# EasyEDA Pro project STM32F103c8t6抄板.eprj

# Schematic Schematic1
Create Date: 2024-08-23; Page Name: P1; Project Name: STM32F103c8t6抄板; Schematic Name: Schematic1; Update Date: 2024-08-26; Company: 嘉立创EDA; Page Size: A4; Version: V1.0
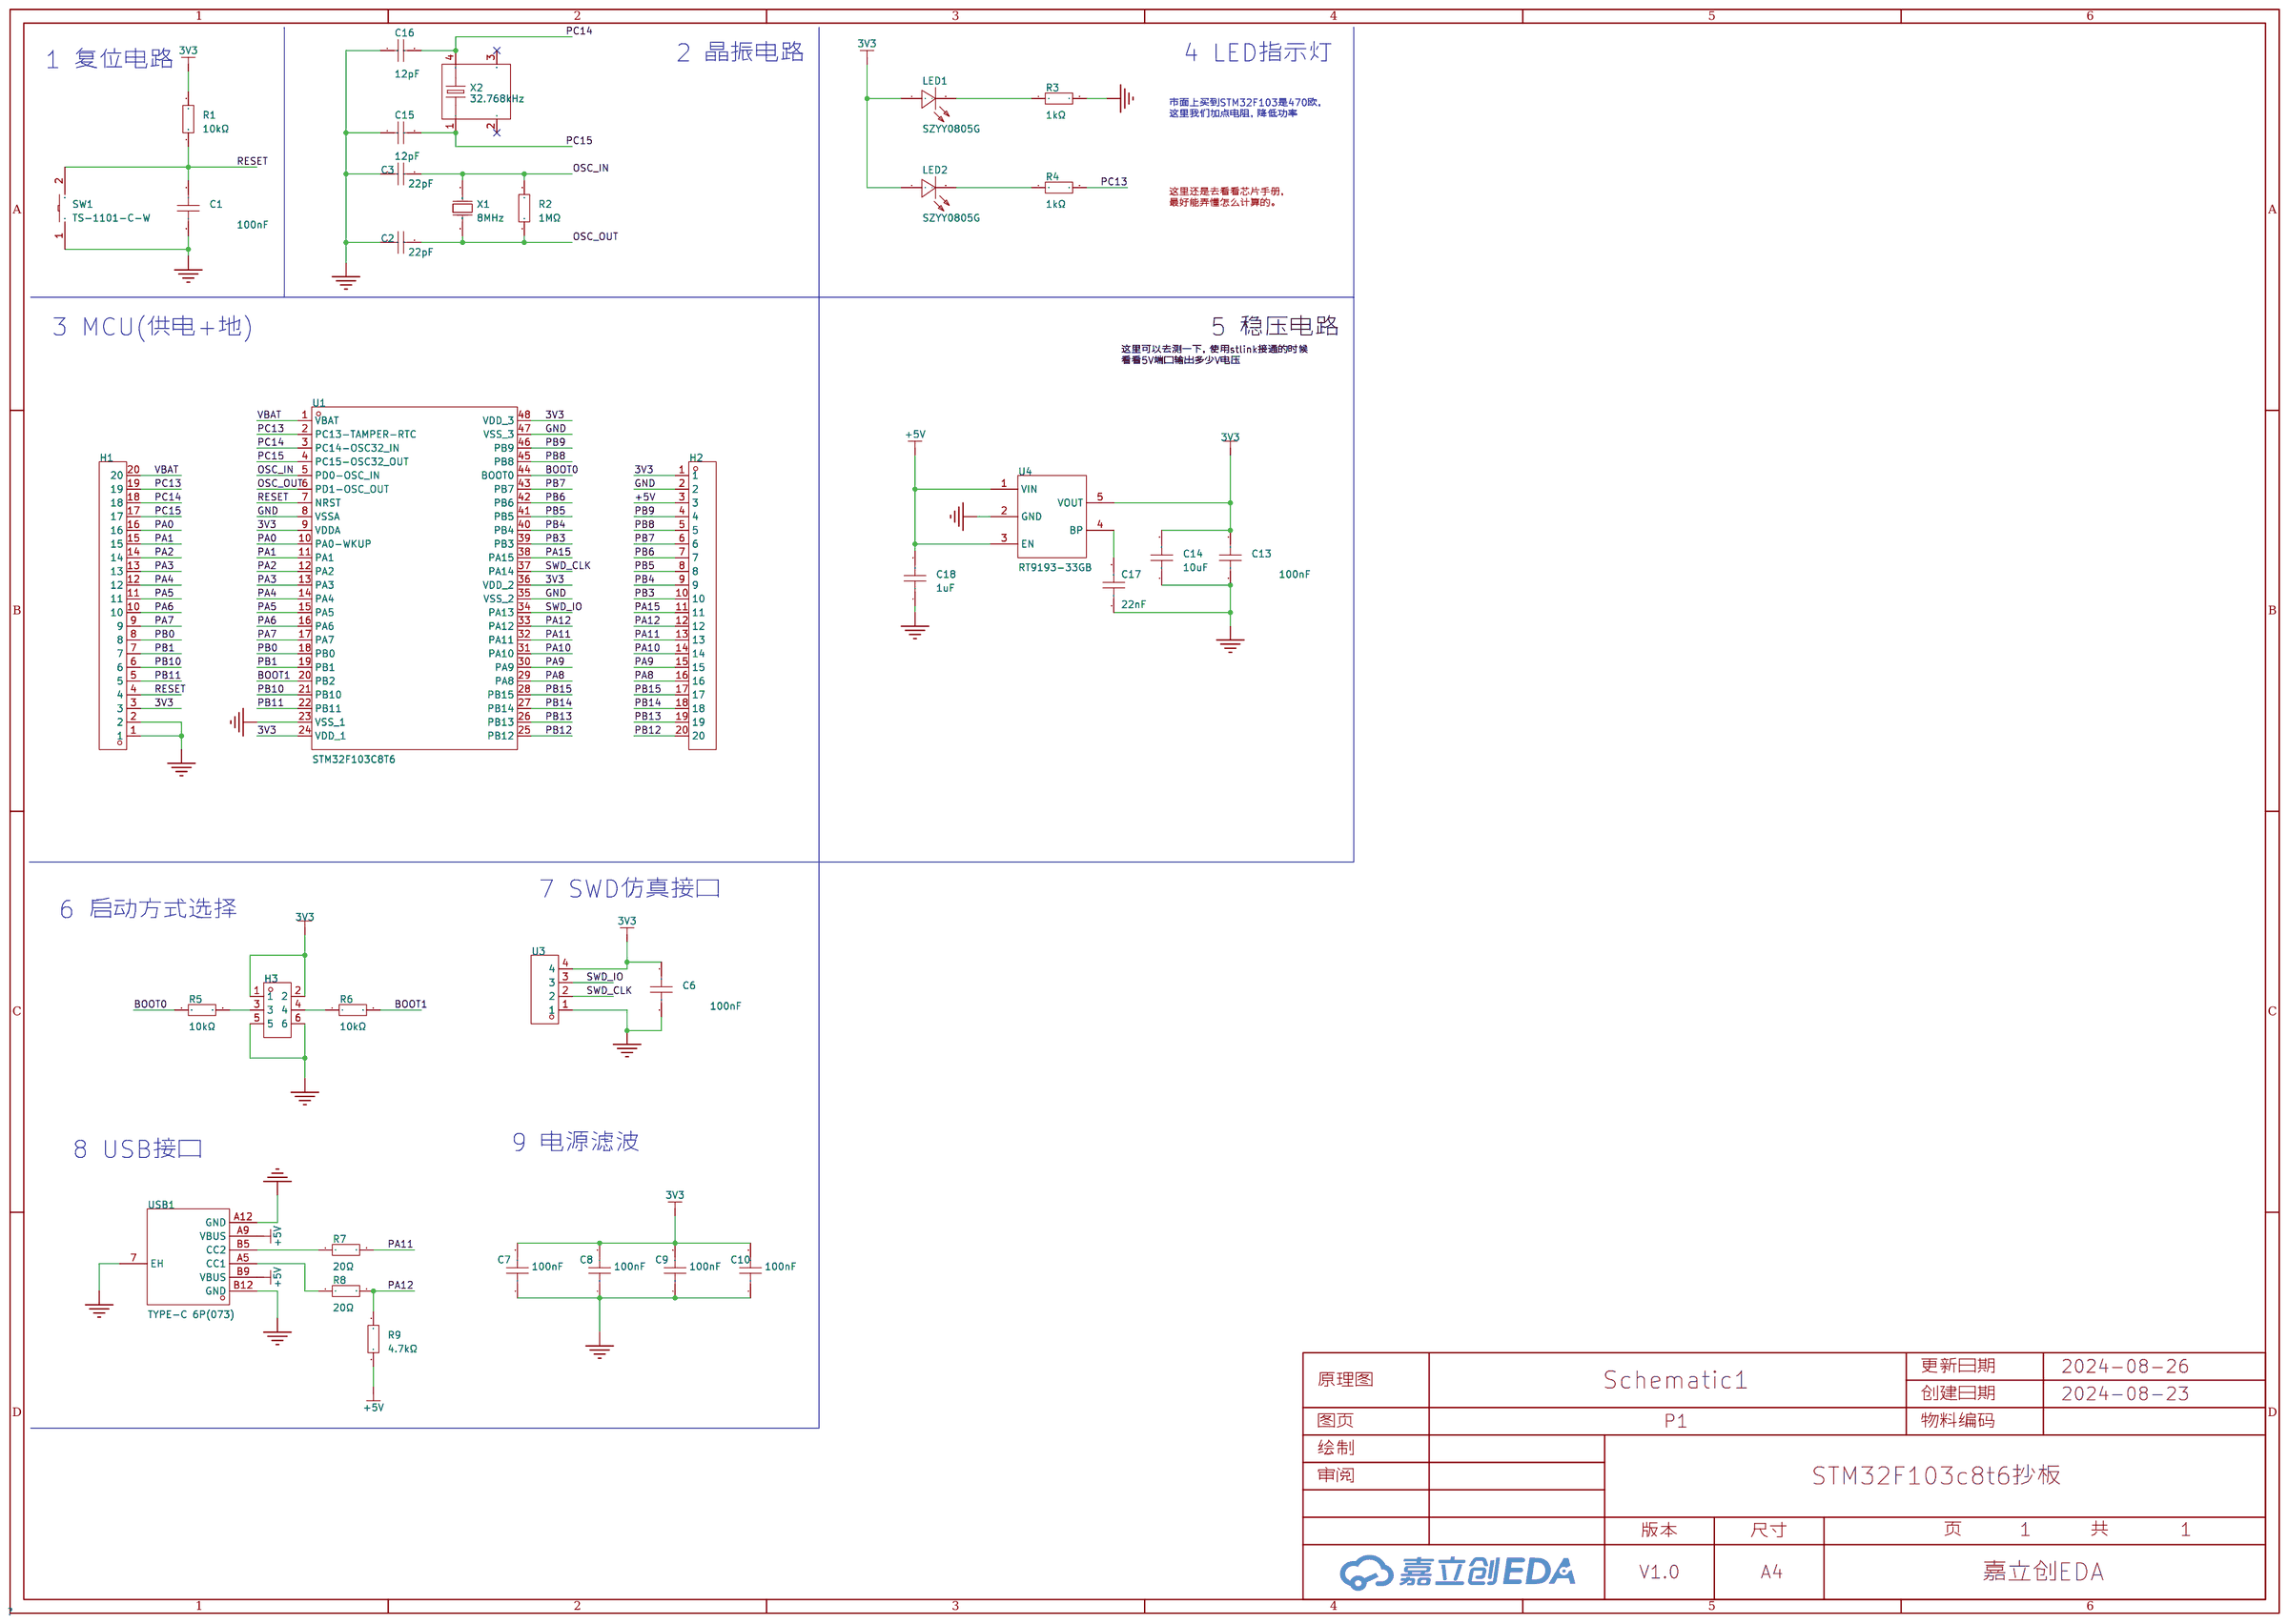
[diagram p0: schematic sheet]

## Parts
C1  100nF  [C0603]
C2  22pF  [C0603]
C3  22pF  [C0603]
C6  100nF  [C0603]
C7  100nF  [C0603]
C8  100nF  [C0603]
C9  100nF  [C0603]
C10  100nF  [C0603]
C13  100nF  [C0603]
C14  10uF  [C0603]
C15  12pF  [C0603]
C16  12pF  [C0603]
C17  22nF  [C0603]
C18  1uF  [C0603]
H1  X6511WV-20H-C60D30  [HDR-TH_20P-P2.54-V-M]
H2  X6511WV-20H-C60D30  [HDR-TH_20P-P2.54-V-M]
H3  PZ254-2-03-Z-8.5  [HDR-TH_6P-P2.54-V-M-R2-C3-S2.54]
LED1  SZYY0805G  [LED0805-R-RD]
LED2  SZYY0805G  [LED0805-R-RD]
R1  10kΩ  [R0603]
R2  1MΩ  [R0603]
R3  1kΩ  [R0603]
R4  1kΩ  [R0603]
R5  10kΩ  [R0603]
R6  10kΩ  [R0603]
R7  20Ω  [R0603]
R8  20Ω  [R0603]
R9  4.7kΩ  [R0603]
SW1  TS-1101-C-W  [SW-SMD_L6.0-W3.3-LS8.0]
U1  STM32F103C8T6  [LQFP-48_L7.0-W7.0-P0.50-LS9.0-BL]
U3  HB-PH3-25414PB2GOP  [HDR-TH_4P-P2.54-V-M]
U4  RT9193-33GB  [SOT-23-5_L3.0-W1.7-P0.95-LS2.8-BL]
USB1  TYPE-C 6P(073)  [TYPE-C-SMD_TYPE-C-6P_5]
X1  8MHz  [OSC-TH_L10.0-W4.5-P5.00]
X2  32.768kHz  [MC-306_4P-L8.0-W3.2-P5.5-BL]

## Library data of the parts
C1 C6-C10 C13 = CGA0603X7R104K500JT: 容值:100nF;精度:±10%;额定电压:50V;材质(温度系数):X7R;; LCSC Part Name: 100nF ±10% 50V; Supplier Part: C6119867; Manufacturer: HRE(芯声); Supplier Footprint: 0603; JLCPCB Part Class: 扩展库; Supplier: LCSC; Tolerance: ±10%; Voltage Rated: 50V; Temperature Coefficient: X7R
C2 C3 = CL10C220JB8NNNC: 容值:22pF;精度:±5%;额定电压:50V;材质(温度系数):C0G;; LCSC Part Name: 22pF ±5% 50V; Supplier Part: C1653; Manufacturer: SAMSUNG(三星); Supplier Footprint: 0603; JLCPCB Part Class: 基础库; Datasheet: https://atta.szlcsc.com/upload/public/pdf/source/20160218/1457707763339.pdf; Supplier: LCSC; Tolerance: ±5%; Voltage Rated: 50V; Temperature Coefficient: C0G
C14 = GRM188R6YA106MA73D: 容值:10uF;精度:±20%;额定电压:35V;材质(温度系数):X5R;; LCSC Part Name: 10uF ±20% 35V; Supplier Part: C194427; Manufacturer: muRata(村田); Supplier Footprint: 0603; JLCPCB Part Class: 扩展库; Datasheet: https://atta.szlcsc.com/upload/public/pdf/source/20210128/C194427_FCA3640823207DDB58700A82F1A19B5F.pdf; Supplier: LCSC; Tolerance: ±20%; Voltage Rated: 35V; Temperature Coefficient: X5R
C15 C16 = CL10C120JB8NNNC: 容值:12pF;精度:±5%;额定电压:50V;材质(温度系数):C0G;; LCSC Part Name: 12pF ±5% 50V; Supplier Part: C38523; Manufacturer: SAMSUNG(三星); Supplier Footprint: 0603; JLCPCB Part Class: 基础库; Datasheet: https://atta.szlcsc.com/upload/public/pdf/source/20160218/1457707763339.pdf; Supplier: LCSC; Tolerance: ±5%; Voltage Rated: 50V; Temperature Coefficient: C0G
C17 = CC0603KRX7R0BB223: 容值:22nF;精度:±10%;额定电压:100V;材质(温度系数):X7R;; LCSC Part Name: 22nF ±10% 100V; Supplier Part: C313105; Manufacturer: YAGEO(国巨); Supplier Footprint: 0603; JLCPCB Part Class: 扩展库; Datasheet: https://atta.szlcsc.com/upload/public/pdf/source/20181015/C313105_CEA3435B2B492CE5017C28CCC9DC0C08.pdf; Supplier: LCSC; Tolerance: ±10%; Voltage Rated: 100V; Temperature Coefficient: X7R
C18 = CL10A105KB8NNNC: 容值:1uF;精度:±10%;额定电压:50V;材质(温度系数):X5R;; LCSC Part Name: 1uF ±10% 50V; Supplier Part: C15849; Manufacturer: SAMSUNG(三星); Supplier Footprint: 0603; JLCPCB Part Class: 基础库; Datasheet: https://atta.szlcsc.com/upload/public/pdf/source/20160218/1457707763339.pdf; Supplier: LCSC; Tolerance: ±10%; Voltage Rated: 50V; Temperature Coefficient: X5R
H1 H2 = X6511WV-20H-C60D30: 插针结构:1x20P;间距:2.54mm;行距:2.54mm;圆针/方针:方针;安装类型:-;排数:单排;总PIN位数:20P;额定电流:3A;额定电压:250V;配合针长度:-;塑高:2.5mm;端接针长度:-;触头材质:黄铜;触头镀层:金;工作温度范围:-40℃~+105℃;焊接温度(最大值):260℃;颜色:黑色;; LCSC Part Name: 1x20P 间距:2.54mm 方针; Supplier Part: C725952; Manufacturer: XKB Connection(中国星坤); Supplier Footprint: 插件,P=2.54mm; JLCPCB Part Class: 扩展库; Datasheet: https://atta.szlcsc.com/upload/public/pdf/source/20221108/2FDDF9C694C8EDC81165E23F2EAAE597.pdf; Supplier: LCSC; Pin Structure: 1x20P; Pitch: 2.54mm; Row Spacing: 2.54mm; Circluar Pins/Square Pins: 方针; Number of Rows: 单排; Number of Pins: 20P; Current Rating (Max): 3A; Voltage Rating (Max): 250V; Insulation Height: 2.5mm; Contact Material: 黄铜; Contact Plating: 金; Operating Temperature Range: -40℃~+105℃; Soldering Temperature(Max): 260℃; Color: 黑色
H3 = PZ254-2-03-Z-8.5_C2894964: 插针结构:2x3P;间距:2.54mm;行距:2.54mm;圆针/方针:方针;安装类型:直插;排数:双排;总PIN位数:6P;额定电流:3A;额定电压:-;配合针长度:6mm;塑高:2.5mm;端接针长度:3mm;触头材质:黄铜;工作温度范围:-40℃~+105℃;焊接温度(最大值):260℃@10S;颜色:黑色;; LCSC Part Name: 2x3P 间距:2.54mm 方针 直插; Supplier Part: C2894964; Manufacturer: HCTL(华灿天禄); Supplier Footprint: 插件,P=2.54mm; JLCPCB Part Class: 扩展库; Datasheet: https://atta.szlcsc.com/upload/public/pdf/source/20230609/5BA09C8BEB9B31376F8BF6032FF67CAC.pdf; Supplier: LCSC; Pin Structure: 2x3P; Pitch: 2.54mm; Row Spacing: 2.54mm; Circluar Pins/Square Pins: 方针; Mounting Type: 直插; Number of Rows: 双排; Number of Pins: 6P; Current Rating (Max): 3A; Length of Mating Pin: 6mm; Insulation Height: 2.5mm; Length of End Connection Pin: 3mm; Contact Material: 黄铜; Operating Temperature Range: -40℃~+105℃; Soldering Temperature(Max): 260℃@10S; Color: 黑色
LED1 LED2 = SZYY0805G: 发光颜色:翠绿色;; LCSC Part Name: 翠绿; Supplier Part: C434432; Manufacturer: yongyu(永裕光电); Supplier Footprint: 0805; JLCPCB Part Class: 扩展库; Datasheet: https://atta.szlcsc.com/upload/public/pdf/source/20191204/C434432_9975307E99FEDF79FC6902370AFE95E6.pdf; Supplier: LCSC; Emitted Color: 翠绿色
R1 R5 R6 = 0603WAF1002T5E: 电阻类型:厚膜电阻;阻值:10kΩ;精度:±1%;功率:100mW;最大工作电压:75V;温度系数:±100ppm/℃;; LCSC Part Name: 厚膜电阻 10kΩ ±1% 100mW; Supplier Part: C25804; Manufacturer: UNI-ROYAL(厚声); Supplier Footprint: 0603; JLCPCB Part Class: 基础库; Datasheet: https://atta.szlcsc.com/upload/public/pdf/source/20200306/C422600_1E6D84923E4A46A82E41ADD87F860B5C.pdf; Supplier: LCSC; Type: 厚膜电阻; Tolerance: ±1%; Power(Watts): 100mW; Overload Voltage (Max): 75V; Temperature Coefficient: ±100ppm/℃; Operating Temperature Range: -55℃~+155℃
R2 = 0603WAF1004T5E: 电阻类型:厚膜电阻;阻值:1MΩ;精度:±1%;功率:100mW;最大工作电压:75V;温度系数:±100ppm/℃;; LCSC Part Name: 1MΩ ±1% 100mW 厚膜电阻; Supplier Part: C22935; Manufacturer: UNI-ROYAL(厚声); Supplier Footprint: 0603; JLCPCB Part Class: 基础库; Datasheet: https://atta.szlcsc.com/upload/public/pdf/source/20200306/C422600_1E6D84923E4A46A82E41ADD87F860B5C.pdf; Supplier: LCSC; Type: 厚膜电阻; Tolerance: ±1%; Power(Watts): 100mW; Overload Voltage (Max): 75V; Temperature Coefficient: ±100ppm/℃; Operating Temperature Range: -55℃~+155℃
R3 R4 = 0603WAF1001T5E: 电阻类型:厚膜电阻;阻值:1kΩ;精度:±1%;功率:100mW;最大工作电压:75V;温度系数:±100ppm/℃;; LCSC Part Name: 1kΩ ±1% 100mW 厚膜电阻; Supplier Part: C21190; Manufacturer: UNI-ROYAL(厚声); Supplier Footprint: 0603; JLCPCB Part Class: 基础库; Datasheet: https://atta.szlcsc.com/upload/public/pdf/source/20200306/C422600_1E6D84923E4A46A82E41ADD87F860B5C.pdf; Supplier: LCSC; Type: 厚膜电阻; Tolerance: ±1%; Power(Watts): 100mW; Overload Voltage (Max): 75V; Temperature Coefficient: ±100ppm/℃; Operating Temperature Range: -55℃~+155℃
R7 R8 = 0603WAF200JT5E: 电阻类型:厚膜电阻;阻值:20Ω;精度:±1%;功率:100mW;最大工作电压:75V;温度系数:±100ppm/℃;; LCSC Part Name: 20Ω ±1% 100mW 厚膜电阻; Supplier Part: C22950; Manufacturer: UNI-ROYAL(厚声); Supplier Footprint: 0603; JLCPCB Part Class: 基础库; Datasheet: https://atta.szlcsc.com/upload/public/pdf/source/20200306/C422600_1E6D84923E4A46A82E41ADD87F860B5C.pdf; Supplier: LCSC; Type: 厚膜电阻; Tolerance: ±1%; Power(Watts): 100mW; Overload Voltage (Max): 75V; Temperature Coefficient: ±100ppm/℃; Operating Temperature Range: -55℃~+155℃
R9 = 0603WAF4701T5E: 电阻类型:厚膜电阻;阻值:4.7kΩ;精度:±1%;功率:100mW;最大工作电压:75V;温度系数:±100ppm/℃;; LCSC Part Name: 4.7kΩ ±1% 100mW 厚膜电阻; Supplier Part: C23162; Manufacturer: UNI-ROYAL(厚声); Supplier Footprint: 0603; JLCPCB Part Class: 基础库; Datasheet: https://atta.szlcsc.com/upload/public/pdf/source/20200306/C422600_1E6D84923E4A46A82E41ADD87F860B5C.pdf; Supplier: LCSC; Type: 厚膜电阻; Tolerance: ±1%; Power(Watts): 100mW; Overload Voltage (Max): 75V; Temperature Coefficient: ±100ppm/℃; Operating Temperature Range: -55℃~+155℃
SW1 = TS-1101-C-W: 电路结构:单刀单掷;按钮形状:矩形按钮;作用力:260gf;安装方式:立贴;开关长度:6mm;开关宽度:3.6mm;开关高度:2.5mm;带支架:不带;触点电流:50mA;额定电压(AC):-;额定电压(DC):12V;额定功率:-;绝缘电阻:-;带灯:无;机械寿命:5万次;; LCSC Part Name: 6*3.6*2.5mm 立贴 轻触开关; Supplier Part: C318938; Manufacturer: XKB Connectivity(中国星坤); Supplier Footprint: SMD; JLCPCB Part Class: 扩展库; Datasheet: https://atta.szlcsc.com/upload/public/pdf/source/20200227/C318938_C2E53B1EEDE37D980A33616AC086DE53.pdf; Supplier: LCSC; Circuit: 单刀单掷; Actuator Style: 矩形按钮; Operating Force: 260gf; Mounting Style: 立贴; Switch Length: 6mm; Switch Width: 3.6mm; Switch Height: 2.5mm; Strike Gundam: 不带; Contact Current: 50mA; Voltage Rating (DC): 12V; Actuator/Cap Color: 白色带淡绿; With Lamp: 无; Mechanical Life: 5万次; Operating Temperature: -30℃~+85℃
U1 = STM32F103C8T6: CPU内核:ARM-M3;程序存储容量:64KB;RAM总容量:20KB;GPIO端口数量:37;工作电压范围:2V~3.6V;CPU最大主频:72MHz;程序存储器类型:FLASH;; LCSC Part Name: 主流增强型ARM Cortex-M3 MCU，具有64 KB Flash、72 MHz CPU、电机控制、USB和CAN; Supplier Part: C8734; Manufacturer: ST(意法半导体); Supplier Footprint: LQFP-48(7x7); JLCPCB Part Class: 扩展库; Datasheet: https://atta.szlcsc.com/upload/public/pdf/source/20220812/8363ACEC51AD55ECEB84799464F7CB85.pdf; Supplier: LCSC; CPU Core: ARM-M3; Program Storage Size: 64KB; RAM Size: 20KB; GPIO Ports Number: 37; Operating Voltage Range: 2V~3.6V; CPU Maximum Speed: 72MHz; Program Memory Type: FLASH; Operating Temperature Range: -40℃~+85℃; ADC (Bit): 12bit; Universal Serial Bus: 有; Peripheral/Function: 看门狗；DMA；看门狗；温度传感器; Watchdog: 有; Infrared Data Association: 有; Low-Voltage Detect: 有; Direct Memory Access: 有; Internal Oscillator: 有
U3 = HB-PH3-25414PB2GOP: 插针结构:1x4P;间距:2.54mm;行距:2.54mm;圆针/方针:方针;安装类型:直插;排数:单排;总PIN位数:4P;额定电流:3A;额定电压:250V;配合针长度:6mm;塑高:2.54mm;端接针长度:3mm;触头材质:黄铜;触头镀层:金;工作温度范围:-40℃~+105℃;焊接温度(最大值):260℃;颜色:黑色;; LCSC Part Name: 间距:2.54mm 1x4P 直插 方针; Supplier Part: C6332197; Manufacturer: HANBO(汉博); Supplier Footprint: 插件,P=2.54mm; JLCPCB Part Class: 扩展库; Datasheet: https://atta.szlcsc.com/upload/public/pdf/source/20230803/F72D259687963761DF1B552F3BB84A31.pdf; Supplier: LCSC; Pin Structure: 1x4P; Pitch: 2.54mm; Row Spacing: 2.54mm; Circluar Pins/Square Pins: 方针; Mounting Type: 直插; Number of Rows: 单排; Number of Pins: 4P; Current Rating (Max): 3A; Voltage Rating (Max): 250V; Length of Mating Pin: 6mm; Insulation Height: 2.54mm; Length of End Connection Pin: 3mm; Contact Material: 黄铜; Contact Plating: 金; Operating Temperature Range: -40℃~+105℃; Soldering Temperature(Max): 260℃; Color: 黑色
U4 = RT9193-33GB: 输出类型:固定;最大输入电压:5.5V;输出电压:3.3V;最大输出电流:300mA;电源纹波抑制比(PSRR):70dB;输出极性:正极;; LCSC Part Name: 输入5.5V 输出3.3V 300mA; Supplier Part: C15651; Manufacturer: RICHTEK(立锜); Supplier Footprint: SOT-23-5; JLCPCB Part Class: 扩展库; Datasheet: https://atta.szlcsc.com/upload/public/pdf/source/20130730/1457706628575.pdf; Supplier: LCSC; Output Type: 固定; Maximum Input Voltage: 5.5V; Output Voltage: 3.3V; MAX Output Current: 300mA; Power Supply Rejection Ratio (PSRR): 70dB; Dropout Voltage: 300mV@(300mA); standby current: 130uA; Operating Temperature: -40℃~+125℃; Output Polarity: 正极; Number of Outputs: 1
USB1 = TYPE-C 6P(073): 连接器类型:Type-C;标准:-;公母:母;端口数量:1;触点数量:6P;安装方式:卧贴;额定电流 - 电源:5A;工作温度范围:-25℃~+85℃;; LCSC Part Name: Type-C 母 卧贴; Supplier Part: C668623; Manufacturer: SHOU HAN(首韩); Supplier Footprint: SMD; JLCPCB Part Class: 扩展库; Datasheet: https://atta.szlcsc.com/upload/public/pdf/source/20200618/C668623_A4B260DED7AC1949BAC6AE39E9F4CD80.pdf; Supplier: LCSC; Connector Type: Type-C; Gender: 母; Number of Ports: 1; Number of Contacts: 6P; Mounting Style: 卧贴; Current Rating - Power (Max): 5A; Operating Temperature Range: -25℃~+85℃
X1 = X49SD8MSD2SC: 晶振类型:直插晶振;频率:8MHz;常温频差:±20ppm;外接负载电容:20pF;频率稳定度(全温):±30ppm;; LCSC Part Name: 8MHz ±20ppm 20pF; Supplier Part: C21263; Manufacturer: YXC(扬兴晶振); Supplier Footprint: HC-49S; JLCPCB Part Class: 扩展库; Datasheet: https://atta.szlcsc.com/upload/public/pdf/source/20240329/977D7F2434F98B2BE33270BB9FF3D86D.pdf; Supplier: LCSC; Crystal Type: 直插晶振; Normal temperature Frequency Tolerance: ±20ppm; External load capacitor: 20pF; Frequency Stability(Full temperature range): ±30ppm; Operating Temperature: -20℃~+70℃
X2 = Q13MC30620006: 晶振类型:贴片晶振;频率:32.768kHz;常温频差:±20ppm;外接负载电容:6pF;; LCSC Part Name: 32.768kHz ±20ppm 6pF; Supplier Part: C83979; Manufacturer: EPSON(爱普生); Supplier Footprint: MC-306; JLCPCB Part Class: 扩展库; Datasheet: https://atta.szlcsc.com/upload/public/pdf/source/20180731/C241260_AF798C86898BAAAE0568DDF804E65B58.pdf; Supplier: LCSC; Crystal Type: 贴片晶振; Normal temperature Frequency Tolerance: ±20ppm; External load capacitor: 6pF; Equivalent Series Resistance (ESR): 35kΩ; Operating Temperature: -40℃~+85℃

## Nets
3V3: C6.2 C7.2 C8.2 C9.2 C10.2 C13.2 C14.2 H1.3 H2.1 H3.1 H3.2 LED1.1(+) LED2.1(+) R1.2 U1.9(VDDA) U1.24(VDD_1) U1.36(VDD_2) U1.48(VDD_3) U3.4 U4.5(VOUT)
+5V: C18.2 H2.3 R9.1 U4.1(VIN) U4.3(EN) USB1.A9(VBUS) USB1.B9(VBUS)
GND: C1.1 C2.1 C3.1 C6.1 C7.1 C8.1 C9.1 C10.1 C13.1 C14.1 C15.1 C16.1 C17.1 C18.1 H1.1 H1.2 H2.2 H3.5 H3.6 R3.2 SW1.1 U1.8(VSSA) U1.23(VSS_1) U1.35(VSS_2) U1.47(VSS_3) U3.1 U4.2(GND) USB1.7(EH) USB1.A12(GND) USB1.B12(GND)
VBAT: H1.20 U1.1(VBAT)
BOOT0: R5.1 U1.44(BOOT0)
BOOT1: R6.2 U1.20(PB2)
OSC_IN: C3.2 R2.2 U1.5(PD0-OSC_IN) X1.1(OSC1)
OSC_OUT: C2.2 R2.1 U1.6(PD1-OSC_OUT) X1.2(OSC2)
PA0: H1.16 U1.10(PA0-WKUP)
PA1: H1.15 U1.11(PA1)
PA2: H1.14 U1.12(PA2)
PA3: H1.13 U1.13(PA3)
PA4: H1.12 U1.14(PA4)
PA5: H1.11 U1.15(PA5)
PA6: H1.10 U1.16(PA6)
PA7: H1.9 U1.17(PA7)
PA8: H2.16 U1.29(PA8)
PA9: H2.15 U1.30(PA9)
PA10: H2.14 U1.31(PA10)
PA11: H2.13 R7.2 U1.32(PA11)
PA12: H2.12 R8.2 R9.2 U1.33(PA12)
PA15: H2.11 U1.38(PA15)
PB0: H1.8 U1.18(PB0)
PB1: H1.7 U1.19(PB1)
PB3: H2.10 U1.39(PB3)
PB4: H2.9 U1.40(PB4)
PB5: H2.8 U1.41(PB5)
PB6: H2.7 U1.42(PB6)
PB7: H2.6 U1.43(PB7)
PB8: H2.5 U1.45(PB8)
PB9: H2.4 U1.46(PB9)
PB10: H1.6 U1.21(PB10)
PB11: H1.5 U1.22(PB11)
PB12: H2.20 U1.25(PB12)
PB13: H2.19 U1.26(PB13)
PB14: H2.18 U1.27(PB14)
PB15: H2.17 U1.28(PB15)
PC13: H1.19 R4.2 U1.2(PC13-TAMPER-RTC)
PC14: C16.2 H1.18 U1.3(PC14-OSC32_IN) X2.4
PC15: C15.2 H1.17 U1.4(PC15-OSC32_OUT) X2.1
RESET: C1.2 H1.4 R1.1 SW1.2 U1.7(NRST)
SWD_CLK: U1.37(PA14) U3.2
SWD_IO: U1.34(PA13) U3.3
$1N4416: LED1.2(-) R3.1
$1N4419: LED2.2(-) R4.1
$1N5801: H3.3 R5.2
$1N5804: H3.4 R6.1
$1N6145: R7.1 USB1.B5(CC2)
$1N6273: R8.1 USB1.A5(CC1)
$1N7698: C17.2 U4.4(BP)

Not connected (* = marked no-connect by the designer): X2 2* 3*

## Notes on the sheet
- 2 晶振电路
- 4 LED指示灯
- 1 复位电路
- 市面上买到STM32F103是470欧，
  这里我们加点电阻，降低功率
- 这里还是去看看芯片手册，
  最好能弄懂怎么计算的。
- 3 MCU(供电+地)
- 5 稳压电路
- 这里可以去测一下，使用stlink接通的时候
  看看5V端口输出多少V电压
- 7 SWD仿真接口
- 6 启动方式选择
- 8 USB接口
- 9 电源滤波

# Board PCB1
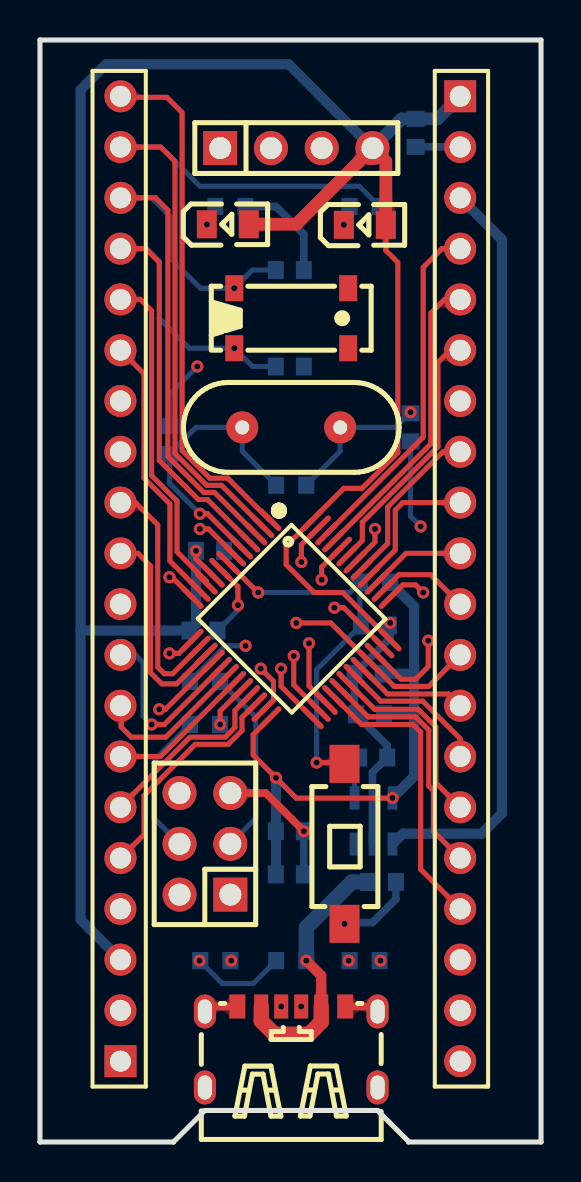
[diagram p1: board, top side]
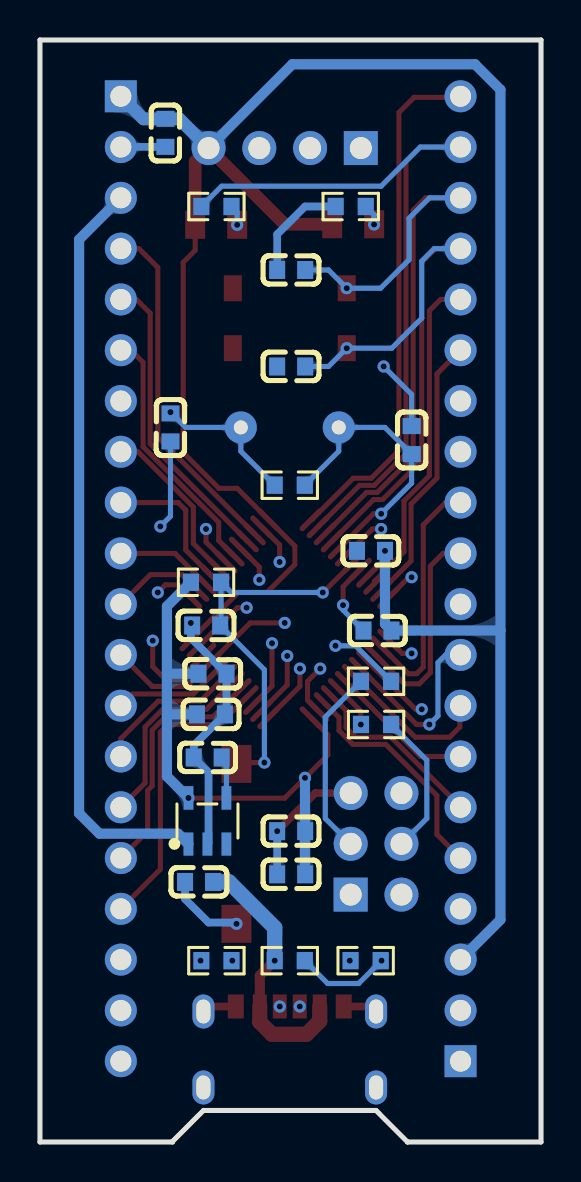
[diagram p2: board, bottom side, seen from below]

Outline 25.07 x 55.12 mm; copper layers: Top Layer, gnd, signal, Bottom Layer. Coordinates in mm from the lower left corner of the outline.
Outline path: 0,0 0,55.12 25.07,55.12 25.07,0 18.44,0 18.44,0.03 16.89,1.58 8.25,1.58 6.68,0 6.68,0 0,0
Stack: Top Layer 0.035mm 外层铜厚1oz / Dielectric1 0.2104mm 7628 RC49% 8.6mil / gnd 0.0152mm 内层铜厚 / Dielectric2 1.065mm 1.1mm H/HOZ 含铜 / signal 0.0152mm 内层铜厚 / Dielectric3 0.2104mm 7628 RC49% 8.6mil / Bottom Layer 0.035mm 外层铜厚1oz

## Design rules (mm)
template: 自定义配置
spacing copperThickness1oz (default): track to track 0.102, other pairs 0.152 to 0.3
spacing copperThickness2oz: track to track 0.203, other pairs 0.152 to 0.3
track width copperThickness1oz (default): min 0.127, default 0.254, max 2.54
track width copperThickness2oz: min 0.203, default 0.254, max 2.54
differential pair differentialPair (default): width min 0.127, default 0.254, max 2.54; gap min 0.152, default 0.152
via viaSize (default): diameter min 0.5, default 0.61, max 10; hole min 0.3, default 0.305, max 6.3
net 3V3 uses 铺铜直连
net +5V uses 铺铜直连

## Placement (name value [footprint] x y rotation side)
C1  100nF  [C0603]  16.76 25.83 180 bottom
C2  22pF  [C0603]  18.54 35.74 90 bottom
C3  22pF  [C0603]  6.48 35.11 270 bottom
C6  100nF  [C0603]  18.8 50.47 90 bottom
C7  100nF  [C0603]  8.51 29.57 180 bottom
C8  100nF  [C0603]  12.5 15.55 180 bottom
C9  100nF  [C0603]  8.18 25.58 180 bottom
C10  100nF  [C0603]  12.5 13.39 180 bottom
C13  100nF  [C0603]  16.52 21.39 0 bottom
C14  10uF  [C0603]  16.44 23.42 0 bottom
C15  12pF  [C0603]  12.5 38.79 180 bottom
C16  12pF  [C0603]  12.5 43.61 180 bottom
C17  22nF  [C0603]  16.68 19.23 180 bottom
C18  1uF  [C0603]  17.11 13.01 180 bottom
H1  X6511WV-20H-C60D30  [HDR-TH_20P-P2.54-V-M]  4.03 28.17 90 top
H2  X6511WV-20H-C60D30  [HDR-TH_20P-P2.54-V-M]  21.03 28.17 270 top
H3  PZ254-2-03-Z-8.5  [HDR-TH_6P-P2.54-V-M-R2-C3-S2.54]  8.25 14.91 90 top
LED1  SZYY0805G  [LED0805-R-RD]  9.4 45.9 0 top
LED2  SZYY0805G  [LED0805-R-RD]  16.26 45.87 0 top
R1  10kΩ  [R0603]  16.76 27.99 0 bottom
R2  1MΩ  [R0603]  12.57 32.85 180 bottom
R3  1kΩ  [R0603]  9.52 46.79 0 bottom
R4  1kΩ  [R0603]  16.24 46.79 0 bottom
R5  10kΩ  [R0603]  8.25 23.04 0 bottom
R6  10kΩ  [R0603]  8.25 20.88 0 bottom
R7  20Ω  [R0603]  16.24 9.07 0 bottom
R8  20Ω  [R0603]  8.78 9.07 180 bottom
R9  4.7kΩ  [R0603]  12.57 9.07 180 bottom
SW1  TS-1101-C-W  [SW-SMD_L6.0-W3.3-LS8.0]  15.24 14.91 90 top
U1  STM32F103C8T6  [LQFP-48_L7.0-W7.0-P0.50-LS9.0-BL]  12.57 26.17 225 top
U3  HB-PH3-25414PB2GOP  [HDR-TH_4P-P2.54-V-M]  12.83 49.71 0 top
U4  RT9193-33GB  [SOT-23-5_L3.0-W1.7-P0.95-LS2.8-BL]  16.69 16.06 180 bottom
USB1  TYPE-C 6P(073)  [TYPE-C-SMD_TYPE-C-6P_5]  12.57 4.75 0 top
X1  8MHz  [OSC-TH_L10.0-W4.5-P5.00]  12.57 35.74 90 top
X2  32.768kHz  [MC-306_4P-L8.0-W3.2-P5.5-BL]  12.57 41.2 0 top

## Footprints (pads in the part's own frame, mm; a bottom-side part is the same pattern mirrored in y, then rotated)
C0603
  rect 0.8x0.9 smd: 1(-0.7,0) 2(0.7,0)
HDR-TH_4P-P2.54-V-M
  rect 1.7x1.7 hole 1.1: 1(-3.81,0)
  round 1.7 hole 1.1: 2(-1.27,0) 3(1.27,0) 4(3.81,0)
HDR-TH_6P-P2.54-V-M-R2-C3-S2.54
  rect 1.7x1.7 hole 1.1: 1(-2.54,-1.27)
  round 1.7 hole 1.1: 2(-2.54,1.27) 3(0,-1.27) 4(0,1.27) 5(2.54,-1.27) 6(2.54,1.27)
HDR-TH_20P-P2.54-V-M
  rect 1.6x1.6 hole 1.05: 1(-24.13,0)
  round 1.6 hole 1.05: 2(-21.59,0) 3(-19.05,0) 4(-16.51,0) 5(-13.97,0) 6(-11.43,0) 7(-8.89,0) 8(-6.35,0) 9(-3.81,0) 10(-1.27,0) 11(1.27,0) 12(3.81,0) 13(6.35,0) 14(8.89,0) 15(11.43,0) 16(13.97,0) 17(16.51,0) 18(19.05,0) 19(21.59,0) 20(24.13,0)
LED0805-R-RD
  rect 1x1.399 smd: 1(1.05,0) 2(-1.05,0)
LQFP-48_L7.0-W7.0-P0.50-LS9.0-BL
  oval 0.27x1.5 smd: 1(-2.75,-4.25) 2(-2.25,-4.25) 3(-1.75,-4.25) 4(-1.25,-4.25) 5(-0.75,-4.25) 6(-0.25,-4.25) 7(0.25,-4.25) 8(0.75,-4.25) 9(1.25,-4.25) 10(1.75,-4.25) 11(2.25,-4.25) 12(2.75,-4.25) 25(2.75,4.25) 26(2.25,4.25) 27(1.75,4.25) 28(1.25,4.25) 29(0.75,4.25) 30(0.25,4.25) 31(-0.25,4.25) 32(-0.75,4.25) 33(-1.25,4.25) 34(-1.75,4.25) 35(-2.25,4.25) 36(-2.75,4.25)
  oval 1.5x0.27 smd: 13(4.25,-2.75) 14(4.25,-2.25) 15(4.25,-1.75) 16(4.25,-1.25) 17(4.25,-0.75) 18(4.25,-0.25) 19(4.25,0.25) 20(4.25,0.75) 21(4.25,1.25) 22(4.25,1.75) 23(4.25,2.25) 24(4.25,2.75) 37(-4.25,2.75) 38(-4.25,2.25) 39(-4.25,1.75) 40(-4.25,1.25) 41(-4.25,0.75) 42(-4.25,0.25) 43(-4.25,-0.25) 44(-4.25,-0.75) 45(-4.25,-1.25) 46(-4.25,-1.75) 47(-4.25,-2.25) 48(-4.25,-2.75)
MC-306_4P-L8.0-W3.2-P5.5-BL
  rect 0.9x1.3 smd: 1(-2.85,-1.5) 2(2.85,-1.5) 3(2.85,1.5) 4(-2.85,1.5)
OSC-TH_L10.0-W4.5-P5.00
  round 1.6 hole 0.7: 1(0,2.45) 2(0,-2.45)
R0603
  rect 0.806x0.864 smd: 1(-0.753,0) 2(0.753,0)
SOT-23-5_L3.0-W1.7-P0.95-LS2.8-BL
  rect 0.49x1.157 smd: 1(-0.95,-1.153) 2(0,-1.153) 3(0.95,-1.153)
  rect 0.49x1.175 smd: 4(0.95,1.153) 5(-0.95,1.153)
SW-SMD_L6.0-W3.3-LS8.0
  rect 1.9x1.5 smd: 1(-4,0) 2(4,0)
TYPE-C-SMD_TYPE-C-6P_5
  oval 1.1x1.7 hole 0.7x1.2: 7(-4.32,1.775) 7(-4.32,-2.025) 7(4.32,1.775) 7(4.32,-2.025)
  rect 0.7x1.2 smd: A5(-0.5,2.025) A9(1.5,2.025) B5(0.5,2.025) B9(-1.5,2.025)
  rect 0.8x1.2 smd: A12(2.7,2.025) B12(-2.7,2.025)

## Nets
As in the schematic.

Pads without a net: X2 2 3

## Via types
v1: diameter 0.61, hole 0.305, Top Layer to Bottom Layer, 42 vias

## Routing (per net, layer and track width the routed paths; a pad name or vN(x,y) marks a point on that pad's centre or on a via; arc(x,y) is an arc through that point)
3V3: length 146.4
  Top Layer w0.254: U1.9 7.81,29.17 v1(7.81,29.57) ; U1.36 15.15,27.49 13.72,27.49 12.32,28.88 12.32,29.81 U1.48 15.21,32.69 16.12,32.69 17.91,34.48 17.91,44 17.31,44.6 LED2.1 ; v1(17.64,17.21) 17.63,17.2 12.83,17.2 v1(11.81,18.22) 10.67,19.36 10.67,20.37 11.51,21.22 U1.24
  Top Layer w0.635: LED2.1 17.31,49.04 U3.4 12.83,45.9 10.45,45.9
  Bottom Layer w0.508: v1(7.81,29.57) 7.81,25.91 C9.2 2.03,25.58 ; C10.2 11.81,13.4 11.81,15.56 ; C14.2 18.69,23.42 18.72,23.45 ; 2.03,25.58 2.03,11.12 H1.3 ; 2.03,25.58 2.03,52.63 3.3,53.9 12.45,53.9 U3.4 ; 18.72,23.45 18.72,26.79 R1.2 ; 18.72,23.45 18.72,21.36 ; 11.81,15.56 C8.2 ; 11.81,15.56 v1(11.81,18.22) ; 18.72,21.36 18.69,21.39 17.22,21.39 ; 18.72,21.36 18.72,18.29 v1(17.64,17.21)
  Bottom Layer w0.635: H2.1 19.9,51.17 C6.2 18.1,51.17 U3.4
+5V: length 51.1
  Top Layer w0.508: USB1.A9 14.07,8.32 v1(13.33,9.07)
  Top Layer w0.762: USB1.A9 14.07,6 13.46,5.39 11.74,5.39 11.07,6.05 USB1.B9
  Bottom Layer w0.508: U4.1 18.16,15.42 22.1,15.42 23.11,16.44 23.11,45.14 21.03,47.22 H2.3
  Bottom Layer w0.762: v1(13.33,9.07) 13.33,10.72 15.61,13.01 C18.2
GND: length 54.3
  Top Layer w0.254: v1(13.08,29.01) 13.08,29.86 U1.47 ; v1(9.91,26.85) 9.91,27.78 9.04,28.65 ; v1(11.05,23.68) 11.68,23.04 11.68,22.1 U1.23 ; v1(14.73,26.72) 15.2,26.72 U1.35
  Top Layer w0.381: USB1.7 8.5,6.78 USB1.B12 ; H3.5 11.3,17.45 v1(13.2,15.55) ; USB1.7 16.64,6.78 USB1.A12
  Bottom Layer w0.254: C2.1 18.54,31.3 v1(19.05,30.79) ; C1.1 17.53,25.9 v1(17.53,25.96) ; v1(9.91,26.85) 9.91,26.6 C9.1 ; v1(7.87,38.79) 6.48,37.39 C3.1
  Bottom Layer w0.381: H2.2 21.02,49.77 C6.1 ; v1(13.2,15.55) 13.2,13.39 ; 17.53,25.9 17.53,25.21 C14.1 15.74,21.47 C13.1 17.38,19.83 C17.1 16.64,18.49 16.64,14.96 U4.2 ; v1(15.24,10.91) 15.3,10.98 16.64,10.98 17.81,12.15 C18.1 ; R3.2 11.81,46.79 13.2,45.4 13.2,43.61
VBAT: length 26.2
  Top Layer w0.254: U1.1 11.48,31.12 9.4,33.2 8.49,33.2 7.11,34.58 7.11,51.49 6.35,52.25 4.08,52.25 H1.20
BOOT0: length 11.3
  Top Layer w0.254: v1(14.1,28.12) 14.1,28.76 U1.44
  signal w0.254: v1(14.1,28.12) 12.45,28.12 10.29,25.96 v1(10.29,24.82)
  Bottom Layer w0.254: v1(10.29,24.82) 9.28,24.82 R5.1
BOOT1: length 2.2
  Top Layer w0.254: v1(9.02,20.88) 9.02,21.56 U1.20
OSC_IN: length 14.2
  Top Layer w0.254: v1(8,31.42) 8.38,31.42 U1.5
  Bottom Layer w0.254: R2.2 10.12,34.55 X1.1 7.81,35.74 C3.2 6.48,32.95 v1(8,31.42)
OSC_OUT: length 29.1
  Top Layer w0.254: U1.6 8.44,30.66 v1(8,30.66)
  signal w0.254: v1(8,30.66) 7.57,30.66 7.24,30.99 7.24,37.27 8,38.03 17.02,38.03 v1(18.54,36.5)
  Bottom Layer w0.254: v1(18.54,36.5) 17.78,35.74 X1.2 15.02,34.55 R2.1
PA0: length 16.6
  Top Layer w0.254: U1.10 8.33,28.05 6.86,29.52 6.86,32.06 5.59,33.33 5.59,41.58 5.02,42.14 H1.16
PA1: length 13.7
  Top Layer w0.254: H1.15 5.21,38.42 5.21,33.21 6.5,31.91 6.5,29.06 U1.11
PA2: length 12
  Top Layer w0.254: U1.12 6.61,28.25 v1(6.48,28.25)
  signal w0.254: v1(6.48,28.25) 5.72,29.01 5.72,36.38 5.03,37.06 H1.14
PA3: length 13
  Top Layer w0.254: v1(6.48,24.44) 6.95,24.44 U1.13
  signal w0.254: v1(6.48,24.44) 6.48,27.42 5.36,28.54 5.36,33.94 4.78,34.52 H1.13
PA4: length 12.2
  Top Layer w0.254: H1.12 4.78,31.98 5.89,30.86 5.89,23.75 6.22,23.42 6.64,23.42 U1.14
PA5: length 10.7
  Top Layer w0.254: H1.11 4.9,29.44 5.54,28.81 5.54,23.47 6.1,22.91 6.84,22.91 U1.15
PA6: length 10.2
  Top Layer w0.254: U1.16 6.28,21.64 v1(5.97,21.64)
  signal w0.254: H1.10 4.78,26.9 5.46,26.22 5.46,22.15 v1(5.97,21.64)
PA7: length 9.2
  Top Layer w0.254: v1(5.59,20.88) 6.22,20.88 9.04,23.7
  Bottom Layer w0.254: H1.9 4.78,24.36 5.16,23.98 5.16,21.31 v1(5.59,20.88)
PA8: length 12.3
  Top Layer w0.254: U1.29 16.42,21.26 18.8,21.26 19.46,20.6 19.46,17.81 19.69,17.58 19.69,15.54 H2.16
PA9: length 9.9
  Top Layer w0.254: U1.30 16.75,21.64 18.92,21.64 19.81,20.75 19.81,17.96 H2.15
PA10: length 7.5
  Top Layer w0.254: H2.14 21.03,20.17 19.15,22.05 17.05,22.05 U1.31
PA11: length 36
  Top Layer w0.254: 16.11,23.7 17.4,22.41 20.44,22.41 H2.13
  signal w0.254: H2.13 21.54,21.82 22.48,20.88 22.48,3.1 21.72,2.34 20.07,2.34 18.42,3.99 18.42,7.69 v1(17.04,9.07)
PA12: length 39.6
  Top Layer w0.254: H2.12 19.45,22.79 17.73,22.79 U1.33 14.55,25.96 v1(12.83,25.96)
  signal w0.254: v1(12.83,25.96) 12.4,25.96 10.29,23.85 10.29,22.66 12.83,20.12 14.22,20.12 14.99,19.36 14.99,14.66 10.67,10.34 9.27,10.34 8,9.07 v1(7.98,9.07)
  Bottom Layer w0.254: v1(7.98,9.07) 9.12,7.93 10.68,7.93 R9.2
PA15: length 4.8
  Top Layer w0.254: U1.38 17.96,28.38 19.55,28.38 21.02,26.9 H2.11
PB0: length 7.9
  Top Layer w0.254: H1.8 4.06,21.78 4.06,20.75 4.57,20.25 6.29,20.25 U1.18
PB1: length 7.3
  Top Layer w0.254: U1.19 6.04,19.28 H1.7
PB3: length 4.8
  Top Layer w0.254: H2.10 18.32,29.44 U1.39
PB4: length 7.3
  Top Layer w0.254: U1.40 17.78,29.61 17.78,31.61 18.16,31.98 H2.9
PB5: length 8.4
  Top Layer w0.254: 16.11,28.65 17.4,29.94 17.4,31.76 20.16,34.52 H2.8
PB6: length 10.3
  Top Layer w0.254: v1(16.76,30.66) 16.76,30.01 U1.42
  signal w0.254: v1(16.76,30.66) 16.76,32.82 21.01,37.06 H2.7
PB7: length 12.9
  Top Layer w0.254: U1.43 16.13,30.08 16.13,30.99 19.91,34.78 19.91,38.99 20.52,39.6 H2.6
PB8: length 15.2
  Top Layer w0.254: 14.69,30.06 19.56,34.92 19.56,41.46 20.24,42.14 H2.5
PB9: length 17.6
  Top Layer w0.254: U1.46 19.18,35.25 19.18,43.74 20.12,44.68 H2.4
PB10: length 9.2
  Top Layer w0.254: 10.45,22.28 9.75,21.59 9.75,20.73 9.27,20.25 7.5,20.25 4.03,16.77 H1.6
PB11: length 11.5
  Top Layer w0.254: H1.5 5.21,15.39 5.21,17.33 7.77,19.89 9.42,19.89 10.11,20.58 10.11,21.23 U1.22
PB12: length 30
  Top Layer w0.254: U1.25 12.06,22.79 v1(12.06,23.68)
  signal w0.254: H2.20 18.92,6.15 18.92,22.91 18.16,23.68 v1(12.06,23.68)
PB13: length 27.8
  Top Layer w0.254: U1.26 12.7,22.86 v1(12.7,24.31)
  signal w0.254: v1(12.7,24.31) 18.42,24.31 19.33,23.4 19.33,8.28 H2.19
PB14: length 25.2
  Top Layer w0.254: U1.27 13.46,22.81 v1(13.46,24.95)
  signal w0.254: v1(13.46,24.95) 18.29,24.95 19.69,23.55 19.69,10.46 H2.18
PB15: length 14.8
  Top Layer w0.254: 14.69,22.28 16.1,20.88 18.67,20.88 19.05,20.5 19.05,13.64 H2.17
PC13: length 37.8
  Top Layer w0.254: H1.19 6.05,49.76 6.76,49.05 6.76,34.44 8.35,32.84 9.08,32.84 U1.2
  Bottom Layer w0.254: R4.2 15.98,47.81 8,47.81 6.05,49.76 H1.19
PC14: length 32.2
  Top Layer w0.254: U1.3 8.73,32.49 8.2,32.49 6.4,34.29 6.4,46.6 5.78,47.22 H1.18
  Bottom Layer w0.254: C16.2 10.64,43.61 v1(9.72,42.7) 8.03,42.7 6.6,44.12 6.6,46.2 5.59,47.22 H1.18
PC15: length 30.2
  Top Layer w0.254: 8.38,32.13 7.93,32.13 5.97,34.09 5.97,44 5.28,44.68 H1.17 ; 8.38,32.13 10.45,30.06
  Bottom Layer w0.254: C15.2 10.64,38.79 v1(9.72,39.7) 7.47,39.7 5.97,41.2 5.97,44.06 5.35,44.68 H1.17
RESET: length 34.6
  Top Layer w0.254: v1(10.92,27.49) 10.91,27.49 U1.7 ; v1(13.84,18.98) 15.18,18.98 SW1.2
  signal w0.254: v1(13.84,18.98) 6.35,18.98 5.11,17.73 5.11,12.74 H1.4
  Bottom Layer w0.254: v1(13.84,18.98) 13.84,23.62 16.06,25.83 16.01,25.88 R1.1 15.5,27.49 v1(10.92,27.49)
SWD_CLK: length 34.9
  Top Layer w0.254: v1(19.18,27.49) 18.8,27.87 18.16,27.87 17.53,27.23 U1.37
  signal w0.254: v1(19.18,27.49) 19.81,28.12 22.1,28.12 22.61,28.63 22.61,42.47 21.72,43.36 16.13,43.36 11.56,47.93 U3.2
SWD_IO: length 39.3
  Top Layer w0.254: U1.34 18.08,23.14 18.8,23.14 19.43,23.78 v1(19.43,25.07)
  signal w0.254: U3.3 14.1,48.06 16.26,45.9 21.59,45.9 23.62,43.87 23.62,27.36 21.97,25.71 20.07,25.71 v1(19.43,25.07)
$1N4416: length 1.1
  Bottom Layer w0.254: v1(8.36,45.89) 8.36,46.38 R3.1
$1N4419: length 1
  Bottom Layer w0.254: R4.1 15.21,46.51 v1(15.21,45.87)
$1N5801: length 9.4
  Bottom Layer w0.254: R5.2 10.8,21.25 10.8,16.18 H3.3
$1N5804: length 7.2
  Bottom Layer w0.254: R6.1 5.72,19.1 5.72,16.18 H3.4
$1N6145: length 3.7
  signal w0.254: v1(15.45,9.07) 14.31,7.93 13.59,7.93 13.07,7.41 v1(13.07,6.78)
$1N6273: length 3.7
  signal w0.254: v1(12.07,6.78) 12.07,7.28 11.43,7.93 10.71,7.93 v1(9.57,9.07)
$1N7698: length 2.1
  Bottom Layer w0.254: C17.2 15.74,19 U4.4

## Copper pours and planes (outline as drawn; the poured copper is in the pictures)
3V3 on Bottom Layer: 10.16,13.64 5.84,13.64 5.72,13.52 5.72,10.4 5.66,10.34 3.05,10.34 3.05,7.82 5.74,7.82 5.84,7.93 5.84,9.04 7.39,10.59 12.45,10.59 12.45,14.32 10.84,14.32
+5V on Bottom Layer: 18.22,15.65 18.22,14.21 17.73,13.72 17.12,13.72 17.12,12.3 15.13,12.3 15.13,15.62 16.13,15.62 16.13,14.08 17.3,14.08 17.3,15.65 17.27,15.67 18.2,15.67
GND on Top Layer: -0.25,55.43 25.4,55.43 25.4,-0.33 -0.25,-0.33
GND on Bottom Layer: -0.63,55.81 25.65,55.81 25.65,-0.58 -0.63,-0.58
GND on gnd: 0.26,54.86 24.82,54.86 24.82,0.26 0.26,0.26

Small or netless copper shapes (teardrops, artwork), in the pictures only: 108 on Top Layer, 84 on Bottom Layer, 38 on gnd, 32 on signal
